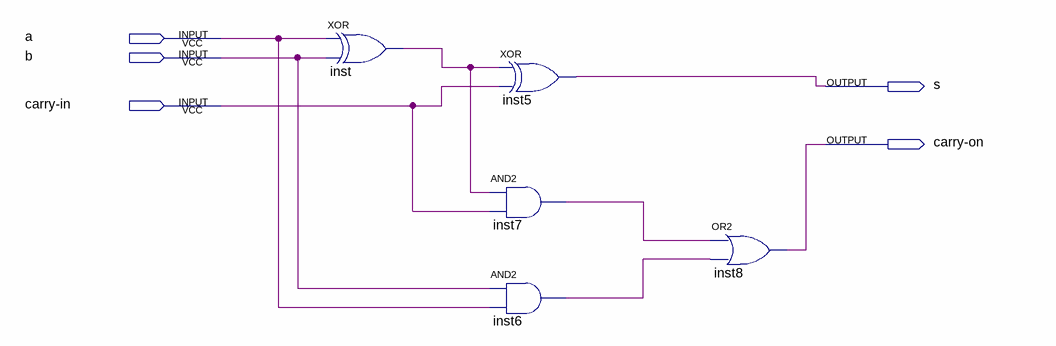
[diagram p0: schematic sheet]
// Quartus schematic sum-bit.bdf as structural Verilog: 5 symbols, 5 pins
module \sum-bit  (
  input  a,
  input  b,
  input  \carry-in ,
  output s,
  output \carry-on 
);

  wire inst6_out, inst7_out, inst_out;

  xor inst (inst_out, a, b);
  and inst7 (inst7_out, inst_out, \carry-in );
  and inst6 (inst6_out, b, a);
  xor inst5 (s, inst_out, \carry-in );
  or inst8 (\carry-on , inst7_out, inst6_out);
endmodule
